# Altium schematic sheet BK1096_TopLevel.SchDoc: =project_title
size Tabloid; PageSetup: Record=PageOptions|CenterHorizontal=True|CenterVertical=True|PrintScale=0.73|XCorrection=1.00|YCorrection=1.00|PrintKind=0|BorderSize=5000000|LeftOffset=0|BottomOffset=0|Orientation=2|PaperLength=1000|PaperWidth=1000|Scale=100|PaperSource=7|PrintQuality=-4|MediaType=1|DitherType=10|PaperKind=A4|PrintScaleMode=1; CompanyName: Luxonis Holding; Organization: Luxonis Holding; Address1: 1925 Harmony Park Drive; Address2: Westminster, CO; Address3: 80234; Address4: United States; SheetNumber: 1; SheetTotal: 6
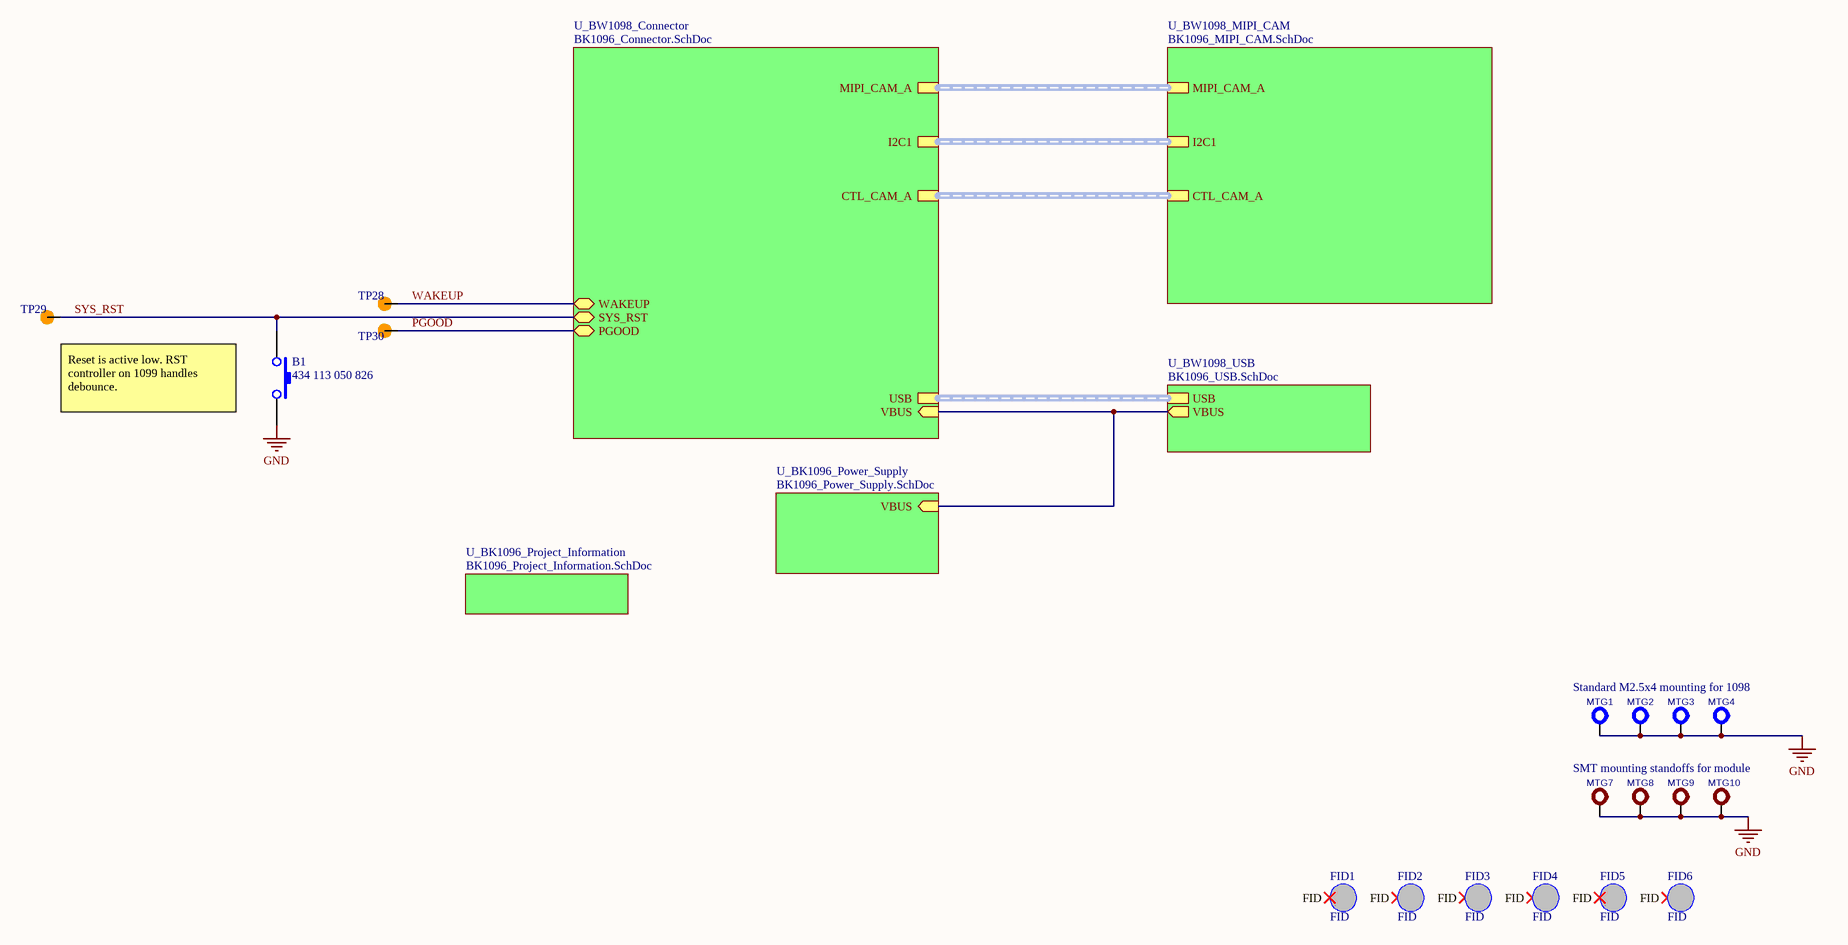
[diagram p0: BK1096_TopLevel.SchDoc]

## Parts
B1  434 113 050 826  [DTSM32N]
FID1  FID  [FIDUCIAL_1MM]  (no BOM)
FID2  FID  [FIDUCIAL_1MM]  (no BOM)
FID3  FID  [FIDUCIAL_1MM]  (no BOM)
FID4  FID  [FIDUCIAL_1MM]  (no BOM)
FID5  FID  [FIDUCIAL_1MM]  (no BOM)
FID6  FID  [FIDUCIAL_1MM]  (no BOM)
MTG1  MTG-HOLE  [SCREW_M2.5x4_RPi]  (value not drawn)  (no BOM)
MTG2  MTG-HOLE  [SCREW_M2.5x4_RPi]  (value not drawn)  (no BOM)
MTG3  MTG-HOLE  [SCREW_M2.5x4_RPi]  (value not drawn)  (no BOM)
MTG4  MTG-HOLE  [SCREW_M2.5x4_RPi]  (value not drawn)  (no BOM)
MTG7  MTG-HOLE  [STANDOFF_M2X0.4_3MM]  (value not drawn)
MTG8  MTG-HOLE  [STANDOFF_M2X0.4_3MM]  (value not drawn)
MTG9  MTG-HOLE  [STANDOFF_M2X0.4_3MM]  (value not drawn)
MTG10  MTG-HOLE  [STANDOFF_M2X0.4_3MM]  (value not drawn)
TP28  TP_SMD  [TP_0.75MM_SMD_NO-SILK]  (value not drawn)  (no BOM)
TP29  TP_SMD  [TP_0.75MM_SMD_NO-SILK]  (value not drawn)  (no BOM)
TP30  TP_SMD  [TP_0.75MM_SMD_NO-SILK]  (value not drawn)  (no BOM)

## Sub-sheets
U_BK1096_Power_Supply = BK1096_Power_Supply.SchDoc: VBUS (in)
U_BK1096_Project_Information = BK1096_Project_Information.SchDoc: no entries
U_BW1098_Connector = BK1096_Connector.SchDoc: MIPI_CAM_A (harness MIPI_CAM_A), I2C1 (harness I2C1), PGOOD (bidir), SYS_RST (bidir), WAKEUP (bidir), CTL_CAM_A (harness CTL_CAM_A), USB (harness USB), VBUS (in)
U_BW1098_MIPI_CAM = BK1096_MIPI_CAM.SchDoc: I2C1 (harness I2C1), MIPI_CAM_A (harness MIPI_CAM_A), CTL_CAM_A (harness CTL_CAM_A)
U_BW1098_USB = BK1096_USB.SchDoc: USB (harness USB), VBUS (out)

## Nets
GND: B1.2 MTG1.1 MTG2.1 MTG3.1 MTG4.1 MTG7.1 MTG8.1 MTG9.1 MTG10.1
PGOOD: TP30.1 ; sheet U_BW1098_Connector/PGOOD
SYS_RST: B1.1 TP29.1 ; sheet U_BW1098_Connector/SYS_RST
WAKEUP: TP28.1 ; sheet U_BW1098_Connector/WAKEUP
(unnamed): sheet U_BW1098_Connector/VBUS, sheet U_BW1098_USB/VBUS, sheet U_BK1096_Power_Supply/VBUS

Not connected (* = marked no-connect by the designer): FID1 FID*; FID2 FID*; FID3 FID*; FID4 FID*; FID5 FID*; FID6 FID*

## Buses and harness runs
harness sheet U_BW1098_Connector/CTL_CAM_A = sheet U_BW1098_MIPI_CAM/CTL_CAM_A
harness sheet U_BW1098_Connector/I2C1 = sheet U_BW1098_MIPI_CAM/I2C1
harness sheet U_BW1098_Connector/MIPI_CAM_A = sheet U_BW1098_MIPI_CAM/MIPI_CAM_A
harness sheet U_BW1098_Connector/USB = sheet U_BW1098_USB/USB

## Notes on the sheet
- Reset is active low. RST controller on 1099 handles debounce.
- Standard M2.5x4 mounting for 1098
- SMT mounting standoffs for module
- Title
- Size:
- Date:
- Tabloid
- Number:
- Time:
- Revision:
- Sheet
- of
- Drawn by:

## Library data of the parts
B1 = SW-PB: Wurth 434 113 050 826; DIST: Farnell; DIST PN: 1868029; ICCO PN: M1V00020; MAN: Wurth; MAN PN: 434 113 050 826
FID1-FID6 = FID: Fiducial mark; MAN PN: No part on PCB; MAN: Fiducial
MTG1-MTG4 = MTG-HOLE: Mounting Hole; B - Value: Not a Part; A - Level: 0; Z - SMD or PTH: PTH; F - MFG P/N: Not a Part; D - my Footprint: SCREW_M2.5x4_RPi
MTG7-MTG10 = MTG-HOLE_B: Mounting Hole; B - Value: Not a Part; A - Level: 0; Z - SMD or PTH: PTH; F - MFG P/N: Not a Part; D - my Footprint: STANDOFF_M2X0.4_3MM
TP28-TP30 = TP_SMD: circular pad test point, SMD